# Altium schematic sheet MCU_PSU_Webench.schdoc
size 295 x 121 mm; SheetNumber: 1; SheetTotal: 1
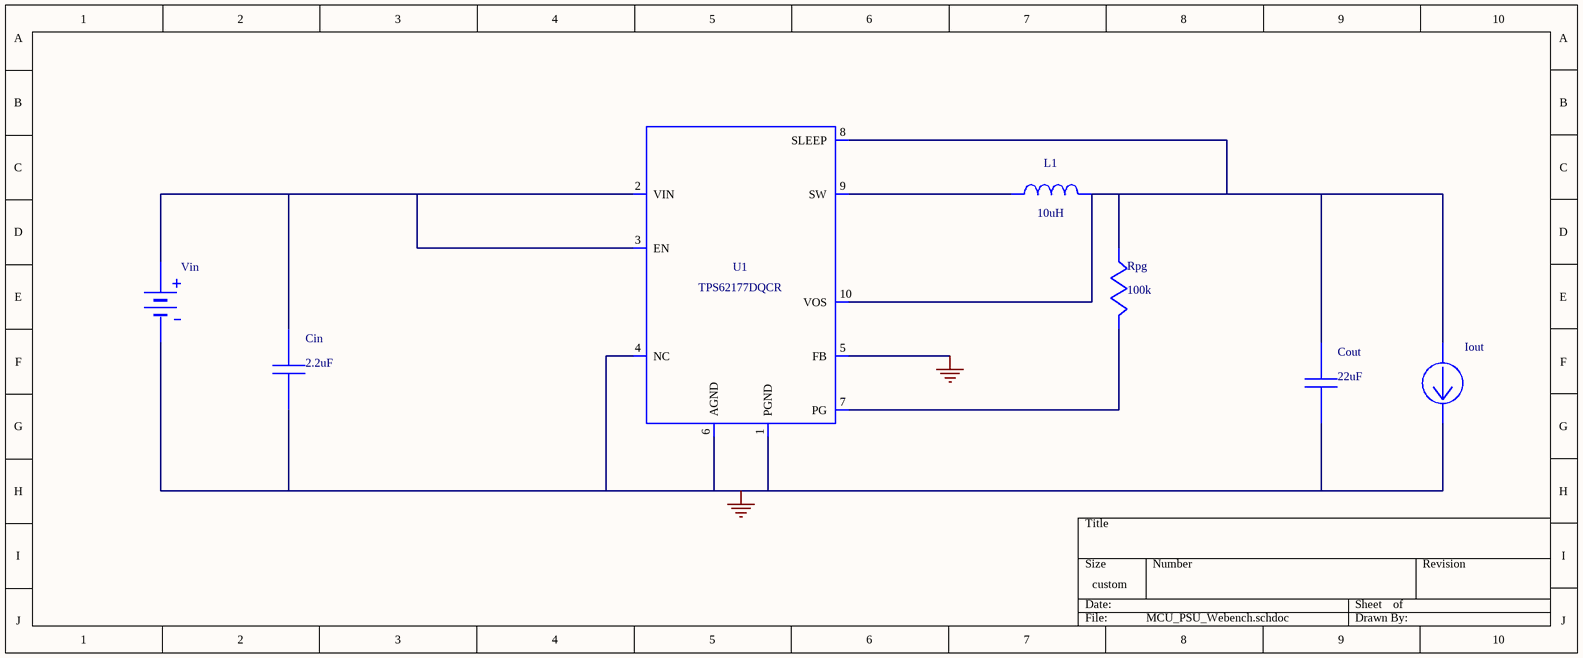
[diagram p0: MCU_PSU_Webench.schdoc]

## Parts
Cin  value 2.2uF  (hidden comment: GRM188R61C225KE15D)
Cout  value 22uF  (hidden comment: GRM21BR60J226ME39L)
Iout  WB_CURRENT_LOAD  (value not drawn)
L1  value 10uH  (hidden comment: SDR0503-100ML)
Rpg  value 100k  (hidden comment: CRCW0402100KFKED)
U1  TPS62175DQCR  (value not drawn)
Vin  WB_BATTERY  (value not drawn)

## Nets
0: Cin.2 Cout.2 Iout.2(-) U1.1(PGND) U1.4(NC) U1.5(FB) U1.6(AGND) U1.11(DAP) Vin.2(-)
NetCin_1: Cin.1 U1.2(VIN) U1.3(EN) Vin.1(+)
NetCout_1: Cout.1 Iout.1(+) L1.2 Rpg.2 U1.8(SLEEP) U1.10(VOS)
NetL1_1: L1.1 U1.9(SW)
NetRpg_1: Rpg.1 U1.7(PG)

## Library data of the parts
Cin = GRM188R61C225KE15D: GRM188R61C225KE1; Manufacturer Name: MuRata; PackageReference: GRM188R61C225KE15D; Manufacturer Part Number: GRM188R61C225KE15D
Cout = GRM21BR60J226ME39L: GRM21BR60J226ME3; Manufacturer Name: MuRata; PackageReference: GRM21BR60J226ME39L; Manufacturer Part Number: GRM21BR60J226ME39L
Iout = WB_CURRENT_LOAD: Value: UNLISTED; PackageReference: WB_CURRENT_LOAD; Manufacturer Part Number: WB_CURRENT_LOAD; Manufacturer Name: WB_CURRENT_LOAD
L1 = SDR0503-100ML: Manufacturer Name: Bourns; PackageReference: SDR0503-100ML; Manufacturer Part Number: SDR0503-100ML
Rpg = CRCW0402100KFKED: Manufacturer Name: Vishay-Dale; PackageReference: CRCW0402100KFKED; Manufacturer Part Number: CRCW0402100KFKED
U1 = TPS62175DQCR: TPS62177DQCR; Manufacturer Name: Texas Instruments; Value: UNLISTED; PackageReference: TPS62177DQCR; Manufacturer Part Number: TPS62175DQCR
Vin = WB_BATTERY: Value: UNLISTED; PackageReference: WB_BATTERY; Manufacturer Part Number: WB_BATTERY; Manufacturer Name: WB_BATTERY